# Altium schematic sheet 09_Antenna.SchDoc
size 420 x 297 mm; Author: Shpakov Dmitry; Address1: Address1; Address2: Address2; Address3: Address3; Address4: Address4; DocumentNumber: АБВГ.123456.001 Э3; SheetNumber: 10; SheetTotal: 13; Scale: 1:1; DocumentType: Схема электрическая принципиальная; FirstReferrence: АБВГ.123456.001
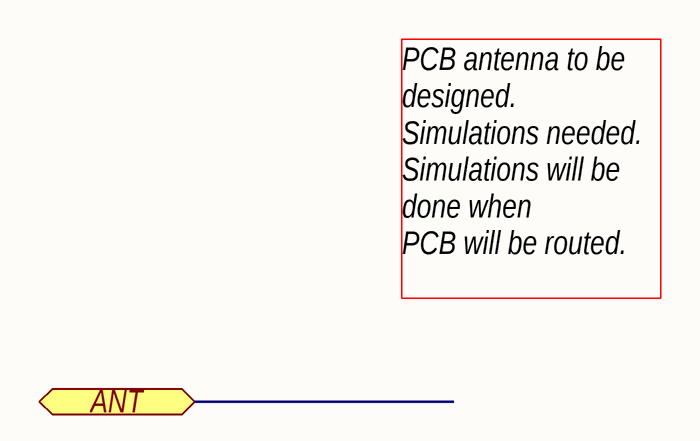
[diagram p0: 09_Antenna.SchDoc]

## Ports
ANT

## Notes on the sheet
- PCB antenna to be designed.
  Simulations needed.
  Simulations will be done when
  PCB will be routed.
- Author
- Manufacturer
- Date
- Page
- Total pages
- Size page
- A3
- Materials